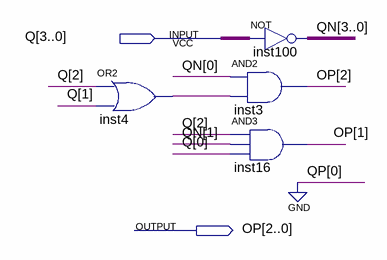
[diagram p0: schematic sheet]
// Quartus schematic OP.bdf as structural Verilog: 4 symbols, 2 pins
module OP (
  input  [3:0] Q,
  output [2:0] OP
);

  wire inst4_out;
  wire [3:0] QN;

  or inst4 (inst4_out, Q[2], Q[1]);
  and inst3 (OP[2], QN[0], inst4_out);
  and inst16 (OP[1], Q[2], QN[1], Q[0]);
  assign QN = ~Q;  // NOT inst100, 4 bits wide
endmodule
